# Altium schematic sheet fpga_io.SchDoc
size A4
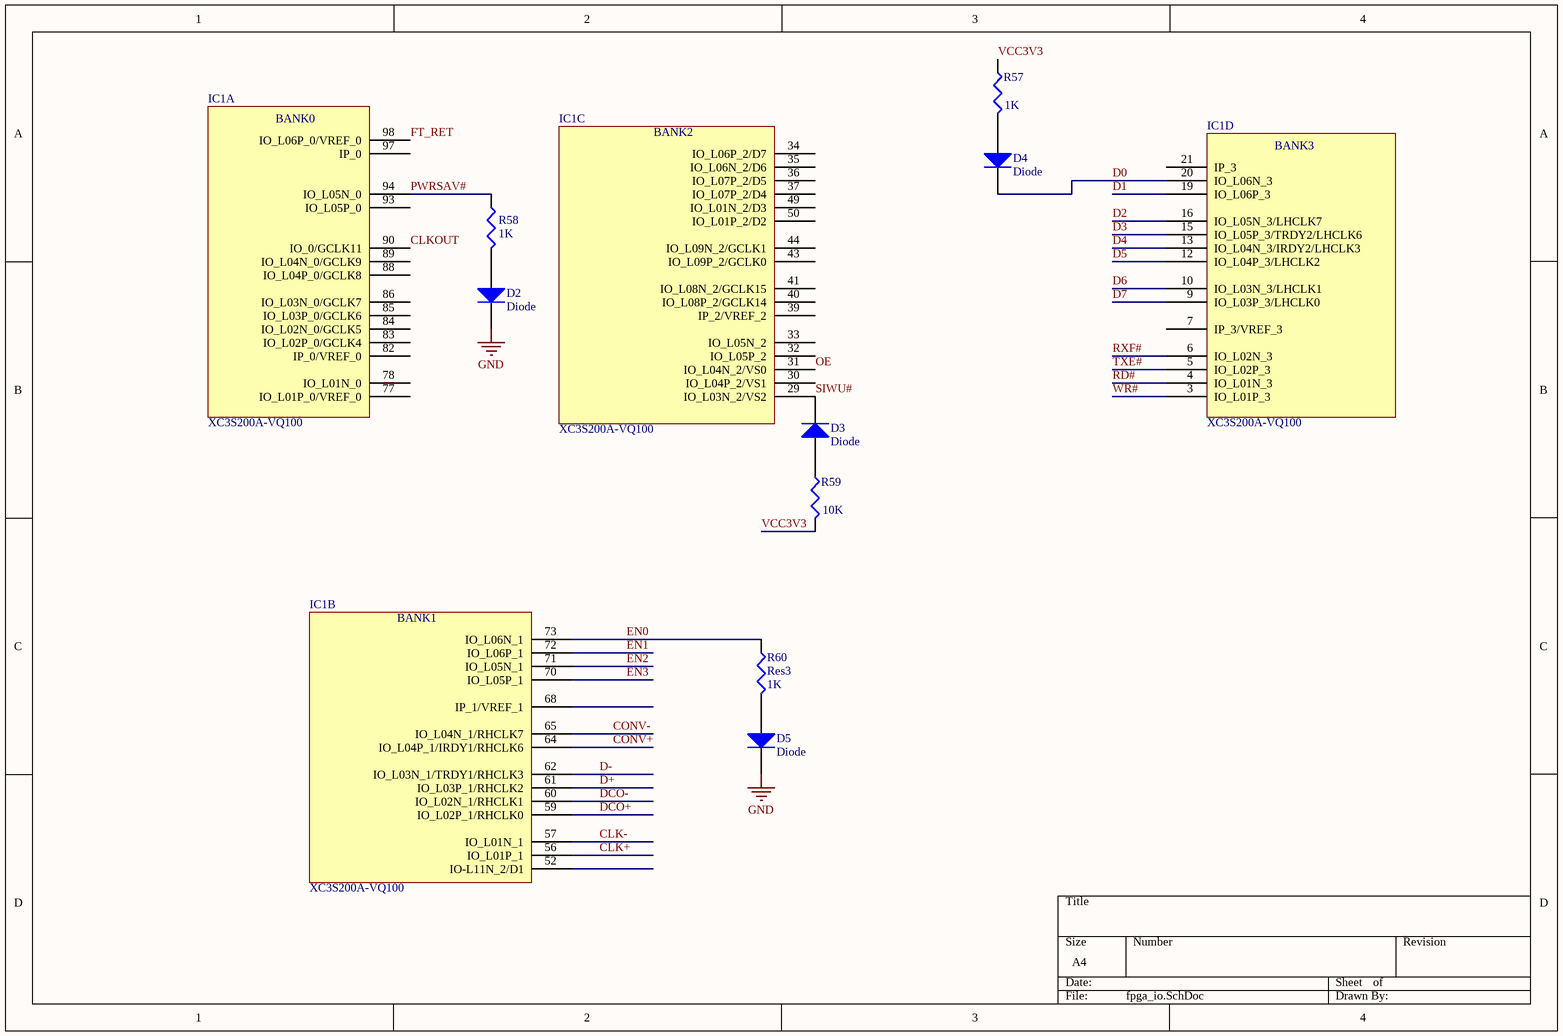
[diagram p0: fpga_io.SchDoc]

## Parts
D2  Diode  [LED0603]
D3  Diode  [LED0603]
D4  Diode  [LED0603]
D5  Diode  [LED0603]
IC1  XC3S200A-VQ100  [QFP50P1600X1600X120-100N]  (parts A,B,C,D of 6)
R57  value 1K  [J1-0603]  (hidden comment: Res3)
R58  value 1K  [J1-0603]  (hidden comment: Res3)
R59  value 10K  [J1-0603]  (hidden comment: Res3)
R60  Res3  value 1K  [J1-0603]

## Nets
GND: D2.2(K) D5.2(K)
CLK+: IC1.56(IO_L01P_1)
CLK-: IC1.57(IO_L01N_1)
CLKOUT: IC1.90(IO_0/GCLK11)
CONV+: IC1.64(IO_L04P_1/IRDY1/RHCLK6)
CONV-: IC1.65(IO_L04N_1/RHCLK7)
D0: D4.2(K) IC1.20(IO_L06N_3)
D1: IC1.19(IO_L06P_3)
D2: IC1.16(IO_L05N_3/LHCLK7)
D3: IC1.15(IO_L05P_3/TRDY2/LHCLK6)
D4: IC1.13(IO_L04N_3/IRDY2/LHCLK3)
D5: IC1.12(IO_L04P_3/LHCLK2)
D6: IC1.10(IO_L03N_3/LHCLK1)
D7: IC1.9(IO_L03P_3/LHCLK0)
D+: IC1.61(IO_L03P_1/RHCLK2)
D-: IC1.62(IO_L03N_1/TRDY1/RHCLK3)
DCO+: IC1.59(IO_L02P_1/RHCLK0)
DCO-: IC1.60(IO_L02N_1/RHCLK1)
EN0: IC1.73(IO_L06N_1) R60.1
EN1: IC1.72(IO_L06P_1)
EN2: IC1.71(IO_L05N_1)
EN3: IC1.70(IO_L05P_1)
FT_RET: IC1.98(IO_L06P_0/VREF_0)
OE: IC1.31(IO_L04N_2/VS0)
PWRSAV#: IC1.94(IO_L05N_0) R58.1
RD#: IC1.4(IO_L01N_3)
RXF#: IC1.6(IO_L02N_3)
SIWU#: D3.2(K) IC1.29(IO_L03N_2/VS2)
TXE#: IC1.5(IO_L02P_3)
VCC3V3: R57.1 R59.2
WR#: IC1.3(IO_L01P_3)
NetD2_1: D2.1(A) R58.2
NetD3_1: D3.1(A) R59.1
NetD4_1: D4.1(A) R57.2
NetD5_1: D5.1(A) R60.2

Not connected (* = marked no-connect by the designer): IC1 7(IP_3/VREF_3) 21(IP_3) 30(IO_L04P_2/VS1) 32(IO_L05P_2) 33(IO_L05N_2) 34(IO_L06P_2/D7) 35(IO_L06N_2/D6) 36(IO_L07P_2/D5) 37(IO_L07P_2/D4) 39(IP_2/VREF_2) 40(IO_L08P_2/GCLK14) 41(IO_L08N_2/GCLK15) 43(IO_L09P_2/GCLK0) 44(IO_L09N_2/GCLK1) 49(IO_L01N_2/D3) 50(IO_L01P_2/D2) 52(IO-L11N_2/D1) 68(IP_1/VREF_1) 77(IO_L01P_0/VREF_0) 78(IO_L01N_0) 82(IP_0/VREF_0) 83(IO_L02P_0/GCLK4) 84(IO_L02N_0/GCLK5) 85(IO_L03P_0/GCLK6) 86(IO_L03N_0/GCLK7) 88(IO_L04P_0/GCLK8) 89(IO_L04N_0/GCLK9) 93(IO_L05P_0) 97(IP_0)

## Notes on the sheet
- (in symbol XC3S200A-VQ100, part A) BANK0
- (in symbol XC3S200A-VQ100, part B) BANK1
- (in symbol XC3S200A-VQ100, part C) BANK2
- (in symbol XC3S200A-VQ100, part D) BANK3

## Library data of the parts
D2-D5 = Diode: Default Diode; Published: 8-Jun-2000; LatestRevisionDate: 17-Jul-2002; LatestRevisionNote: Re-released for DXP Platform.; PackageVersion: Sep-1996; PackageReference: SMC; Publisher: Altium Limited; PackageDescription: DO-214-AB/SMC; 2 C-Bend Leads; Body 7.9 x 5.9 mm, inc. leads (LxW); Code_JEDEC: DO-214-AB
R57-R60 = Res3: Resistor; Published: 8-Jun-2000; LatestRevisionDate: 29-May-2009; LatestRevisionNote: IPC-7351 Footprint Added.; PackageReference: J1-0603; Publisher: Altium Limited; PackageDescription: Chip Resistor